# EasyEDA schematic 1-Schematic_SMALL MODULE.json
TITLE: Sheet_1; REV: 1.0; Date: 2020-03-20; Sheet: 1/1; Drawn By: baddy227; Company: Your Company
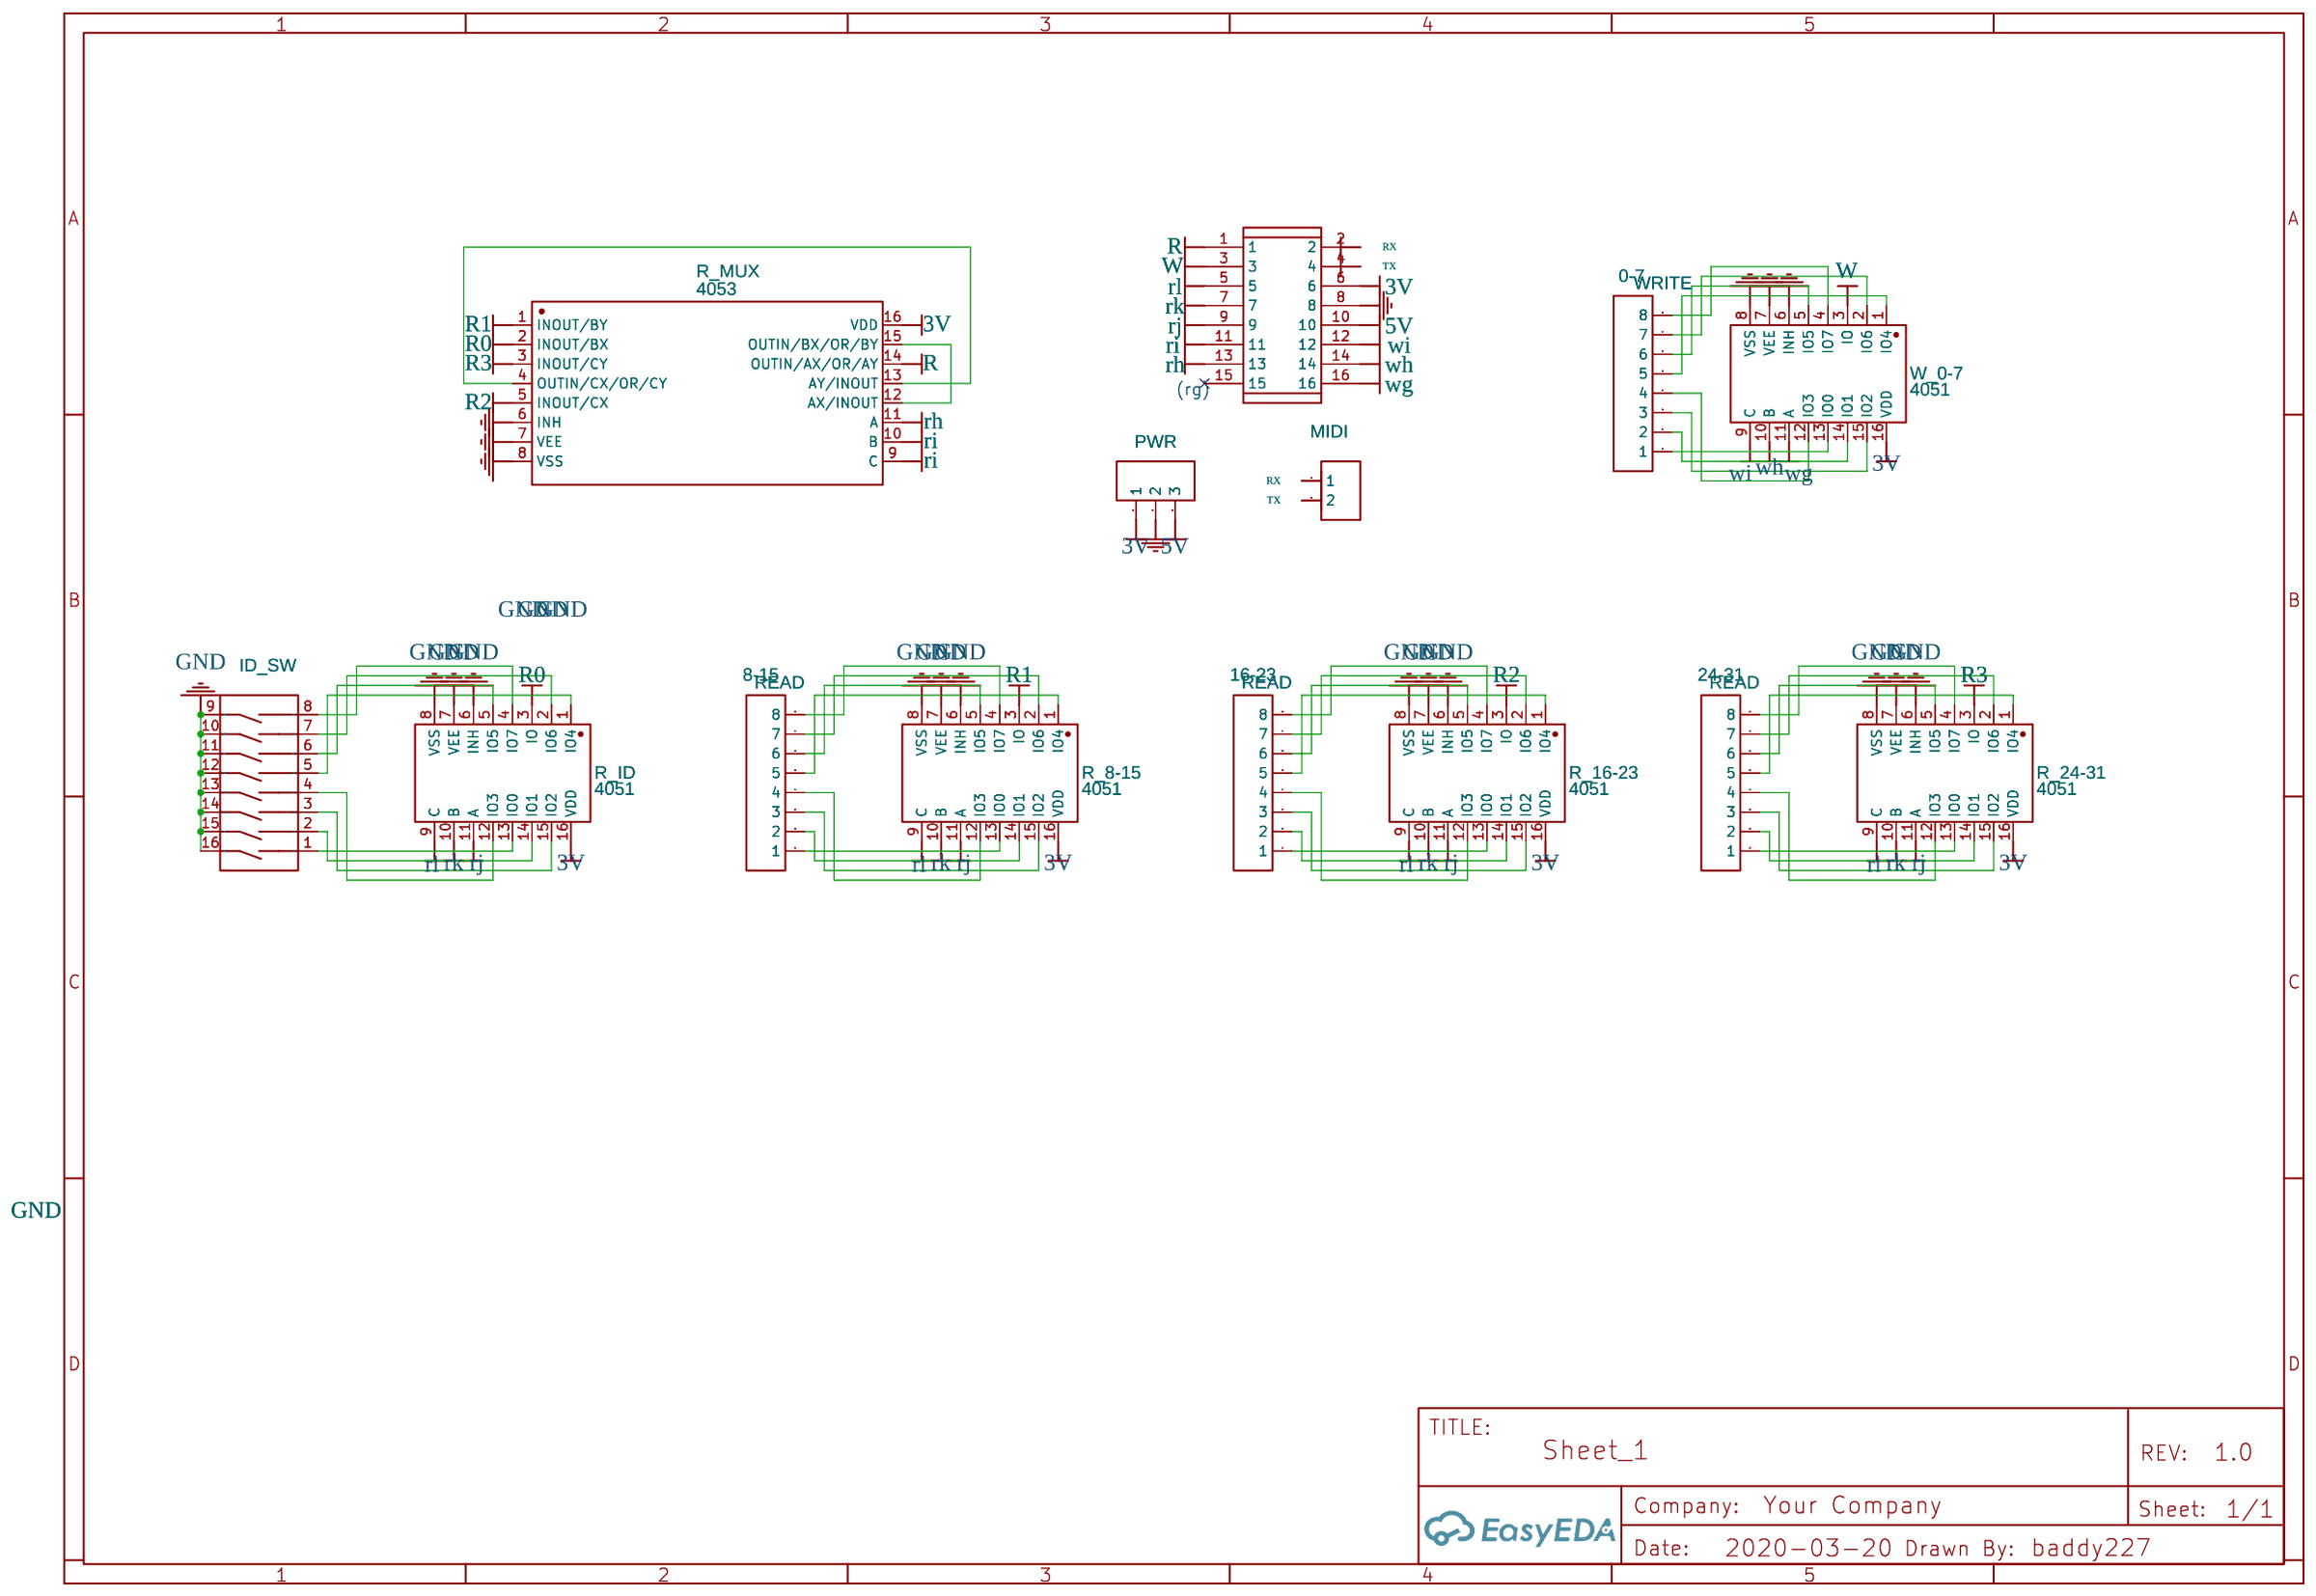
[diagram p0: schematic sheet]

## Parts
0-7  WRITE  [HDR-8X1/2.54]
8-15  READ  [HDR-8X1/2.54]
16-23  READ  [HDR-8X1/2.54]
24-31  READ  [HDR-8X1/2.54]
ID_SW  DIP switchEI-08  [SW-TH_16P-L20.5-W6.0-P2.54]
IDC_16  IDC Box 2X8 2.54MM  [CONN-TH_16P-P2.54_C9142]
MIDI  HDR-M-2.54_1x2  [HDR-M-2.54_1X2]
PWR  Header-Male-2.54_1x3  [HDR-TH_3P-P2.54-V]
R_8-15  4051  [DIP-16_L20.0-W6.4-P2.54-LS7.6-BL]
R_16-23  4051  [DIP-16_L20.0-W6.4-P2.54-LS7.6-BL]
R_24-31  4051  [DIP-16_L20.0-W6.4-P2.54-LS7.6-BL]
R_ID  4051  [DIP-16_L20.0-W6.4-P2.54-LS7.6-BL]
R_MUX  4053  [DIP-16_L20.3-W10.2-P2.54-LS10.2-BL]
W_0-7  4051  [DIP-16_L20.0-W6.4-P2.54-LS7.6-BL]

## Library data of the parts
0-7 = Header-Female-2.54_1x8: Supplier: LCSC; Manufacturer: BOOMELE; Manufacturer Part: Female headerHDR1X8-2.54; Supplier Part: C27438; Package Display: No
8-15 16-23 24-31 = Header-Female-2.54_1x8: Supplier: LCSC; Manufacturer: BOOMELE; Manufacturer Part: Female headerHDR1X8-2.54; Supplier Part: C27438
ID_SW = DIP switchEI-08: Supplier: LCSC; Manufacturer: DIP; Supplier Part: C90019
IDC_16 = IDC Box 2X8 2.54MM: Supplier: LCSC; Manufacturer: BOOMELE; image: //image.lceda.cn/szlcsc/C9142.jpg; Supplier Part: C9142
MIDI = HDR-M-2.54_1x2: Supplier Part: C124375; Supplier: LCSC; Contributor: LCEDA_Lib
PWR = Header-Male-2.54_1x3: Supplier: LCSC; Manufacturer: BOOMELE; Manufacturer Part: Header2.54mm 1*3P; image: //image.lceda.cn/szlcsc/C49257.jpg; Supplier Part: C49257
R_8-15 R_16-23 R_24-31 R_ID W_0-7 = CD4051BE: Supplier: LCSC; Manufacturer: TI; image: //image.lceda.cn/szlcsc/C5200.jpg; Supplier Part: C5200
R_MUX = CD4053BE: Supplier: LCSC; Manufacturer: TI; image: //image.lceda.cn/szlcsc/C5202.jpg; Supplier Part: C5202

## Nets
3V: IDC_16.6 PWR.1 R_8-15.16(VDD) R_16-23.16(VDD) R_24-31.16(VDD) R_ID.16(VDD) R_MUX.16(VDD) W_0-7.16(VDD)
5V: IDC_16.10 PWR.3
GND: ID_SW.9 ID_SW.10 ID_SW.11 ID_SW.12 ID_SW.13 ID_SW.14 ID_SW.15 ID_SW.16 IDC_16.8 PWR.2 R_8-15.6(INH) R_8-15.7(VEE) R_8-15.8(VSS) R_16-23.6(INH) R_16-23.7(VEE) R_16-23.8(VSS) R_24-31.6(INH) R_24-31.7(VEE) R_24-31.8(VSS) R_ID.6(INH) R_ID.7(VEE) R_ID.8(VSS) R_MUX.6(INH) R_MUX.7(VEE) R_MUX.8(VSS) W_0-7.6(INH) W_0-7.7(VEE) W_0-7.8(VSS)
R: IDC_16.1 R_MUX.14(OUTIN/AX/OR/AY)
R0: R_ID.3(IO) R_MUX.2(INOUT/BX)
R1: R_8-15.3(IO) R_MUX.1(INOUT/BY)
R2: R_16-23.3(IO) R_MUX.5(INOUT/CX)
R3: R_24-31.3(IO) R_MUX.3(INOUT/CY)
rh: IDC_16.13 R_MUX.11(A)
ri: IDC_16.11 R_MUX.9(C) R_MUX.10(B)
rj: IDC_16.9 R_8-15.11(A) R_16-23.11(A) R_24-31.11(A) R_ID.11(A)
rk: IDC_16.7 R_8-15.10(B) R_16-23.10(B) R_24-31.10(B) R_ID.10(B)
rl: IDC_16.5 R_8-15.9(C) R_16-23.9(C) R_24-31.9(C) R_ID.9(C)
RX: IDC_16.2 MIDI.1
TX: IDC_16.4 MIDI.2
W: IDC_16.3 W_0-7.3(IO)
wg: IDC_16.16 W_0-7.11(A)
wh: IDC_16.14 W_0-7.10(B)
wi: IDC_16.12 W_0-7.9(C)
Net-(0-7-1): 0-7.1 W_0-7.13(IO0)
Net-(0-7-2): 0-7.2 W_0-7.14(IO1)
Net-(0-7-3): 0-7.3 W_0-7.15(IO2)
Net-(0-7-4): 0-7.4 W_0-7.12(IO3)
Net-(0-7-5): 0-7.5 W_0-7.1(IO4)
Net-(0-7-6): 0-7.6 W_0-7.5(IO5)
Net-(0-7-7): 0-7.7 W_0-7.2(IO6)
Net-(0-7-8): 0-7.8 W_0-7.4(IO7)
Net-(8-15-1): 8-15.1 R_8-15.13(IO0)
Net-(8-15-2): 8-15.2 R_8-15.14(IO1)
Net-(8-15-3): 8-15.3 R_8-15.15(IO2)
Net-(8-15-4): 8-15.4 R_8-15.12(IO3)
Net-(8-15-5): 8-15.5 R_8-15.1(IO4)
Net-(8-15-6): 8-15.6 R_8-15.5(IO5)
Net-(8-15-7): 8-15.7 R_8-15.2(IO6)
Net-(8-15-8): 8-15.8 R_8-15.4(IO7)
Net-(16-23-1): 16-23.1 R_16-23.13(IO0)
Net-(16-23-2): 16-23.2 R_16-23.14(IO1)
Net-(16-23-3): 16-23.3 R_16-23.15(IO2)
Net-(16-23-4): 16-23.4 R_16-23.12(IO3)
Net-(16-23-5): 16-23.5 R_16-23.1(IO4)
Net-(16-23-6): 16-23.6 R_16-23.5(IO5)
Net-(16-23-7): 16-23.7 R_16-23.2(IO6)
Net-(16-23-8): 16-23.8 R_16-23.4(IO7)
Net-(24-31-1): 24-31.1 R_24-31.13(IO0)
Net-(24-31-2): 24-31.2 R_24-31.14(IO1)
Net-(24-31-3): 24-31.3 R_24-31.15(IO2)
Net-(24-31-4): 24-31.4 R_24-31.12(IO3)
Net-(24-31-5): 24-31.5 R_24-31.1(IO4)
Net-(24-31-6): 24-31.6 R_24-31.5(IO5)
Net-(24-31-7): 24-31.7 R_24-31.2(IO6)
Net-(24-31-8): 24-31.8 R_24-31.4(IO7)
Net-(ID_SW-1): ID_SW.1 R_ID.13(IO0)
Net-(ID_SW-2): ID_SW.2 R_ID.14(IO1)
Net-(ID_SW-3): ID_SW.3 R_ID.15(IO2)
Net-(ID_SW-4): ID_SW.4 R_ID.12(IO3)
Net-(ID_SW-5): ID_SW.5 R_ID.1(IO4)
Net-(ID_SW-6): ID_SW.6 R_ID.5(IO5)
Net-(ID_SW-7): ID_SW.7 R_ID.2(IO6)
Net-(ID_SW-8): ID_SW.8 R_ID.4(IO7)
Net-(R_MUX-4): R_MUX.4(OUTIN/CX/OR/CY) R_MUX.13(AY/INOUT)
Net-(R_MUX-12): R_MUX.12(AX/INOUT) R_MUX.15(OUTIN/BX/OR/BY)

Not connected (* = marked no-connect by the designer): IDC_16 15*

## Notes on the sheet
- (rg)
